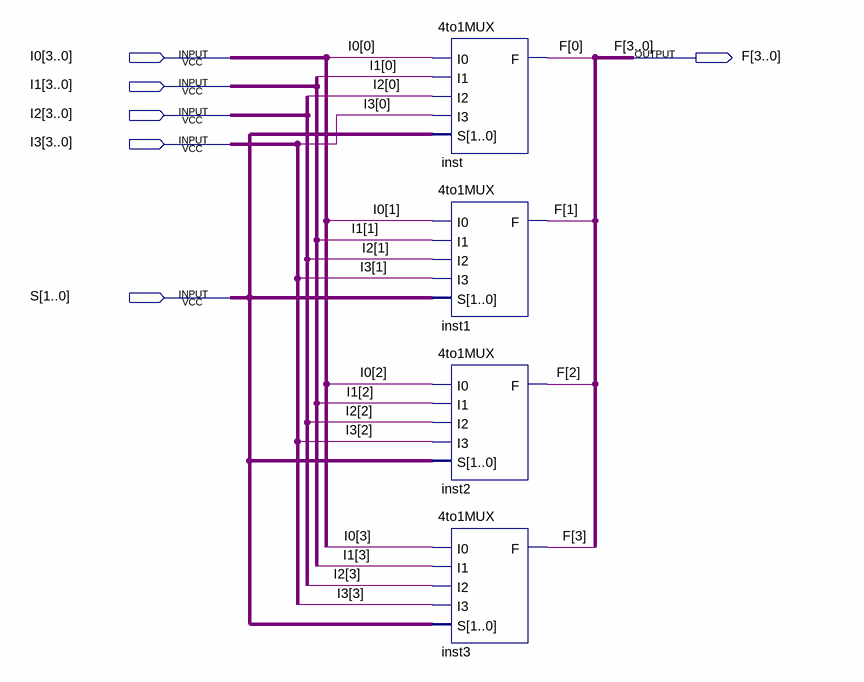
[diagram p0: schematic sheet]
// Quartus schematic 4b_4to1MUX.bdf as structural Verilog: 4 symbols, 6 pins
module \4b_4to1MUX  (
  input  [3:0] I0,
  input  [3:0] I1,
  input  [3:0] I2,
  input  [3:0] I3,
  input  [1:0] S,
  output [3:0] F
);

  \4to1MUX  inst (.I0(I0[0]), .I1(I1[0]), .I2(I2[0]), .I3(I3[0]), .S(S), .F(F[0]));
  \4to1MUX  inst1 (.I0(I0[1]), .I1(I1[1]), .I2(I2[1]), .I3(I3[1]), .S(S), .F(F[1]));
  \4to1MUX  inst2 (.I0(I0[2]), .I1(I1[2]), .I2(I2[2]), .I3(I3[2]), .S(S), .F(F[2]));
  \4to1MUX  inst3 (.I0(I0[3]), .I1(I1[3]), .I2(I2[3]), .I3(I3[3]), .S(S), .F(F[3]));
endmodule
